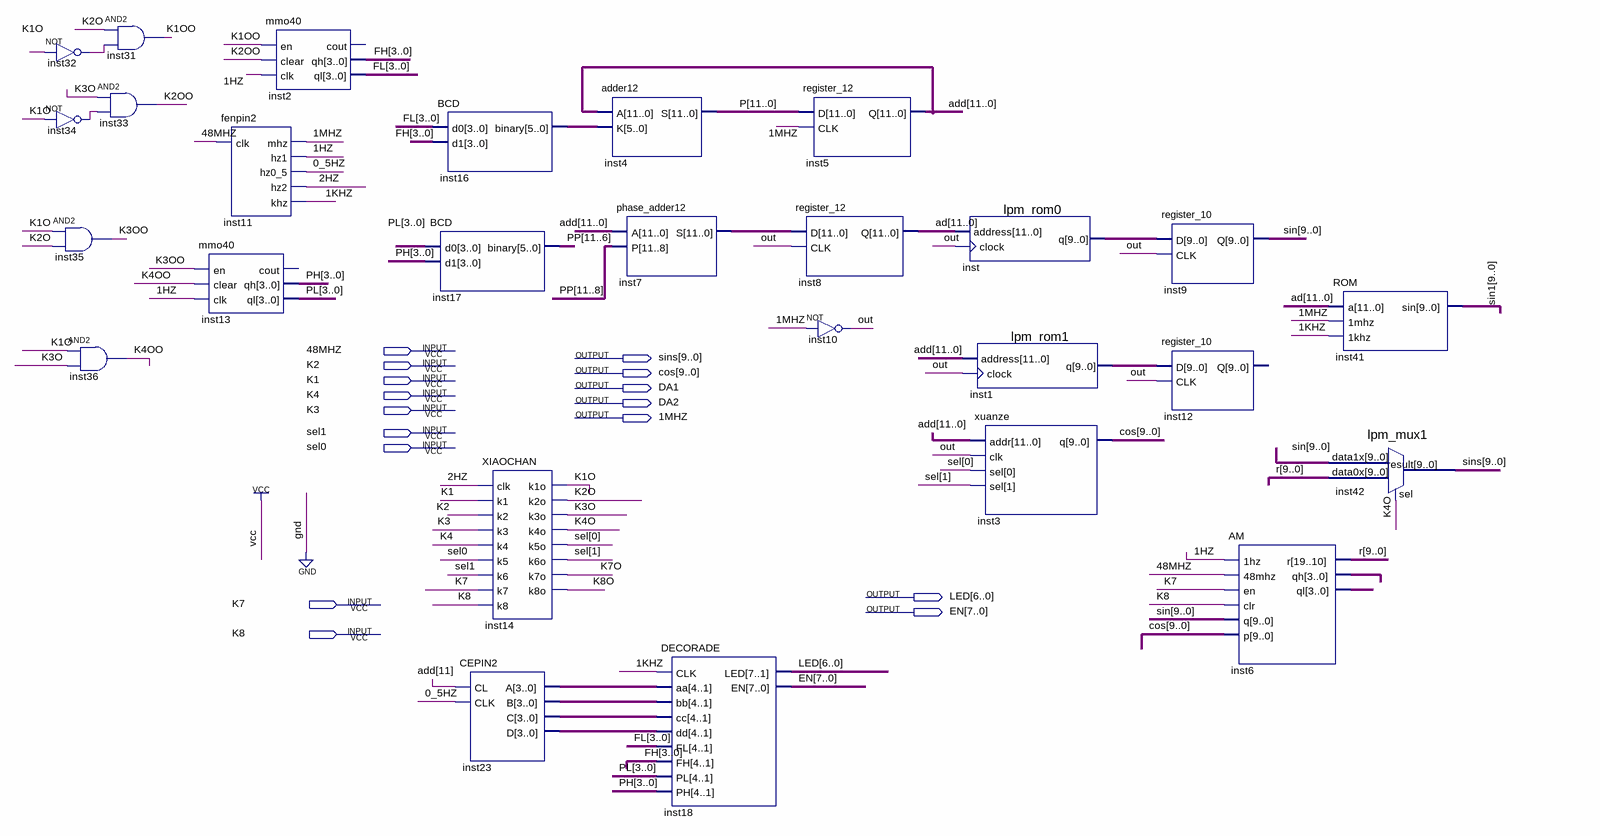
[diagram p0: schematic sheet]
// Quartus schematic circuite.bdf as structural Verilog: 27 symbols, 16 pins
module circuite (
  input  \48MHZ ,
  input  K2,
  input  K1,
  input  K4,
  input  K3,
  input  sel1,
  input  sel0,
  input  K7,
  input  K8,
  output [9:0] sins,
  output [9:0] cos,
  output DA1,
  output DA2,
  output \1MHZ ,
  output [6:0] LED,
  output [7:0] EN
);

  wire \0_5HZ , \1HZ , \1KHZ , \2HZ , inst32_out, inst34_out, K1O, K1OO, K2O, K2OO, K3O, K3OO, K4O, K4OO,
       K7O, K8O, out;
  wire [3:0] FH, FL, inst6_qh, inst6_ql, inst23_a, inst23_b, inst23_c, inst23_d, PH, PL;
  wire [5:0] inst16_binary;
  wire [9:0] inst1_q, inst_q, r, sin, sin1;
  wire [11:0] ad, add, inst7_s, P;
  wire [11:6] PP;

  not inst32 (inst32_out, K1O);
  not inst34 (inst34_out, K1O);
  and inst35 (K3OO, K1O, K2O);
  and inst36 (K4OO, K1O, K3O);
  and inst31 (K1OO, K2O, inst32_out);
  and inst33 (K2OO, K3O, inst34_out);
  mmo40 inst13 (.en(K3OO), .clear(K4OO), .clk(\1HZ ), .qh(PH), .ql(PL));  // open: cout
  fenpin2 inst11 (.clk(\48MHZ ), .mhz(\1MHZ ), .hz1(\1HZ ), .hz0_5(\0_5HZ ), .hz2(\2HZ ), .khz(\1KHZ ));
  mmo40 inst2 (.en(K1OO), .clear(K2OO), .clk(\1HZ ), .qh(FH), .ql(FL));  // open: cout
  BCD inst16 (.d0(FL), .d1(FH), .binary(inst16_binary));
  BCD inst17 (.d0(PL), .d1(PH), .binary(PP));
  XIAOCHAN inst14 (
    .clk(\2HZ ), .k1(K1), .k2(K2), .k3(K3), .k4(K4), .k5(sel0), .k6(sel1), .k7(K7), .k8(K8), .k1o(K1O),
    .k2o(K2O), .k3o(K3O), .k4o(K4O), .k5o(sel0), .k6o(sel1), .k7o(K7O), .k8o(K8O));
  CEPIN2 inst23 (.CL(add[11]), .CLK(\0_5HZ ), .A(inst23_a), .B(inst23_b), .C(inst23_c), .D(inst23_d));
  adder12 inst4 (.A(add), .K(inst16_binary), .S(P));
  phase_adder12 inst7 (.A(add), .P(PP[11:8]), .S(inst7_s));
  DECORADE inst18 (
    .CLK(\1KHZ ), .aa(inst23_a), .bb(inst23_b), .cc(inst23_c), .dd(inst23_d), .FL(FL), .FH(FH), .PL(PL),
    .PH(PH), .LED(LED), .EN(EN));
  register_12 inst8 (.D(inst7_s), .CLK(out), .Q(ad));
  register_12 inst5 (.D(P), .CLK(\1MHZ ), .Q(add));
  not inst10 (out, \1MHZ );
  lpm_rom0 inst (.address(ad), .clock(out), .q(inst_q));
  lpm_rom1 inst1 (.address(add), .clock(out), .q(inst1_q));
  xuanze inst3 (.addr(add), .clk(out), .sel({sel1, sel0}), .q(cos));
  register_10 inst9 (.D(inst_q), .CLK(out), .Q(sin));
  register_10 inst12 (.D(inst1_q), .CLK(out));  // open: Q
  AM inst6 (.\1hz (\1HZ ), .\48mhz (\48MHZ ), .en(K7), .clr(K8), .q(sin), .p(cos), .r(r), .qh(inst6_qh), .ql(inst6_ql));
  ROM inst41 (.a(ad), .\1mhz (\1MHZ ), .\1khz (\1KHZ ), .sin(sin1));
  lpm_mux1 inst42 (.data1x(sin), .data0x(r), .sel(K4O), .result(sins));
endmodule
